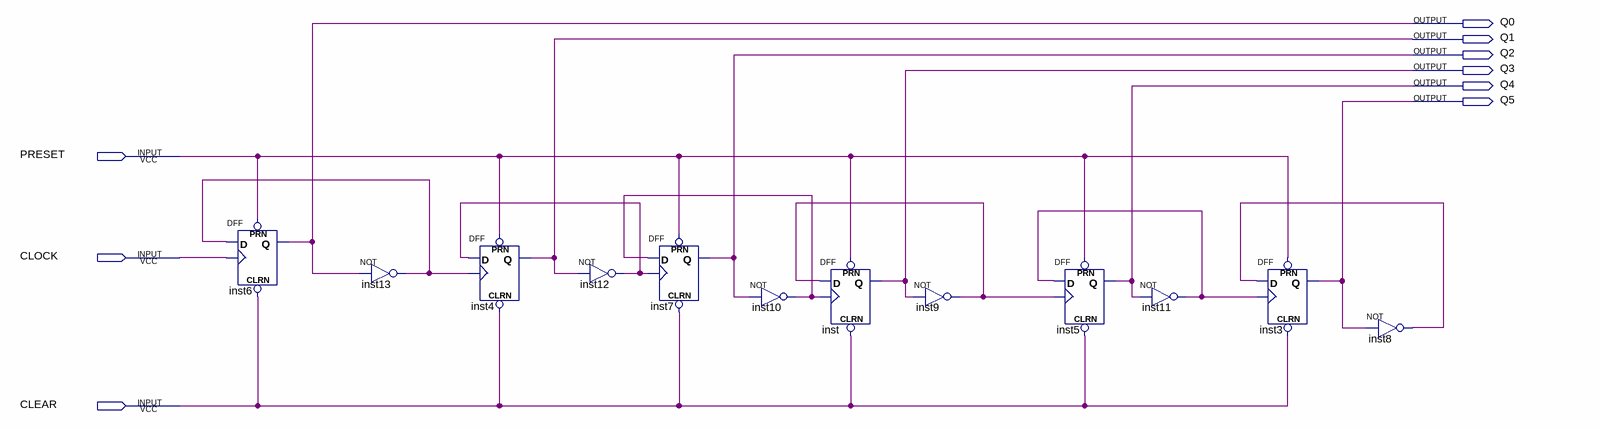
[diagram p0: schematic sheet]
// Quartus schematic FlipflopD.bdf as structural Verilog: 12 symbols, 9 pins
module FlipflopD (
  input  PRESET,
  input  CLOCK,
  input  CLEAR,
  output Q0,
  output Q1,
  output Q2,
  output Q3,
  output Q4,
  output Q5
);

  wire inst8_out, inst9_out, inst10_out, inst11_out, inst12_out, inst13_out;

  DFF inst6 (.CLRN(CLEAR), .CLK(CLOCK), .D(inst13_out), .PRN(PRESET), .Q(Q0));
  not inst13 (inst13_out, Q0);
  DFF inst4 (.CLRN(CLEAR), .CLK(inst13_out), .D(inst12_out), .PRN(PRESET), .Q(Q1));
  not inst12 (inst12_out, Q1);
  DFF inst7 (.CLRN(CLEAR), .CLK(inst12_out), .D(inst10_out), .PRN(PRESET), .Q(Q2));
  not inst10 (inst10_out, Q2);
  DFF inst (.CLRN(CLEAR), .CLK(inst10_out), .D(inst9_out), .PRN(PRESET), .Q(Q3));
  not inst9 (inst9_out, Q3);
  DFF inst5 (.CLRN(CLEAR), .CLK(inst9_out), .D(inst11_out), .PRN(PRESET), .Q(Q4));
  not inst11 (inst11_out, Q4);
  DFF inst3 (.CLRN(CLEAR), .CLK(inst11_out), .D(inst8_out), .PRN(PRESET), .Q(Q5));
  not inst8 (inst8_out, Q5);
endmodule
